# Altium schematic sheet ESC_2S.SchDoc: Init Title in DocParam
size A4; Organization: Use Organization_Name in ProjParam; Address1: Daniel Burnier; Address2: STI-IMT-LSRO1; Address3: EPFL; Address4: CH-1015 LAUSANNE; DocumentNumber: Init DocumentNumber in DocParam; Revision: A; SheetNumber: 1; SheetTotal: 1; ApprovedBy: Init ApprovedBy in DocParam; CheckedBy: Init CheckedBy in DocParam; Author: Init Author in DocParam; CompanyName: Init CompanyName in DocParam; DrawnBy: Init DrawBy in DocParam; Engineer: Init Engineer in DocParam; Title2: Init Title2 in DocParam; DocumentName: Init DocumentName in DocParam; ProjectName: Init ProjectName in DocParam
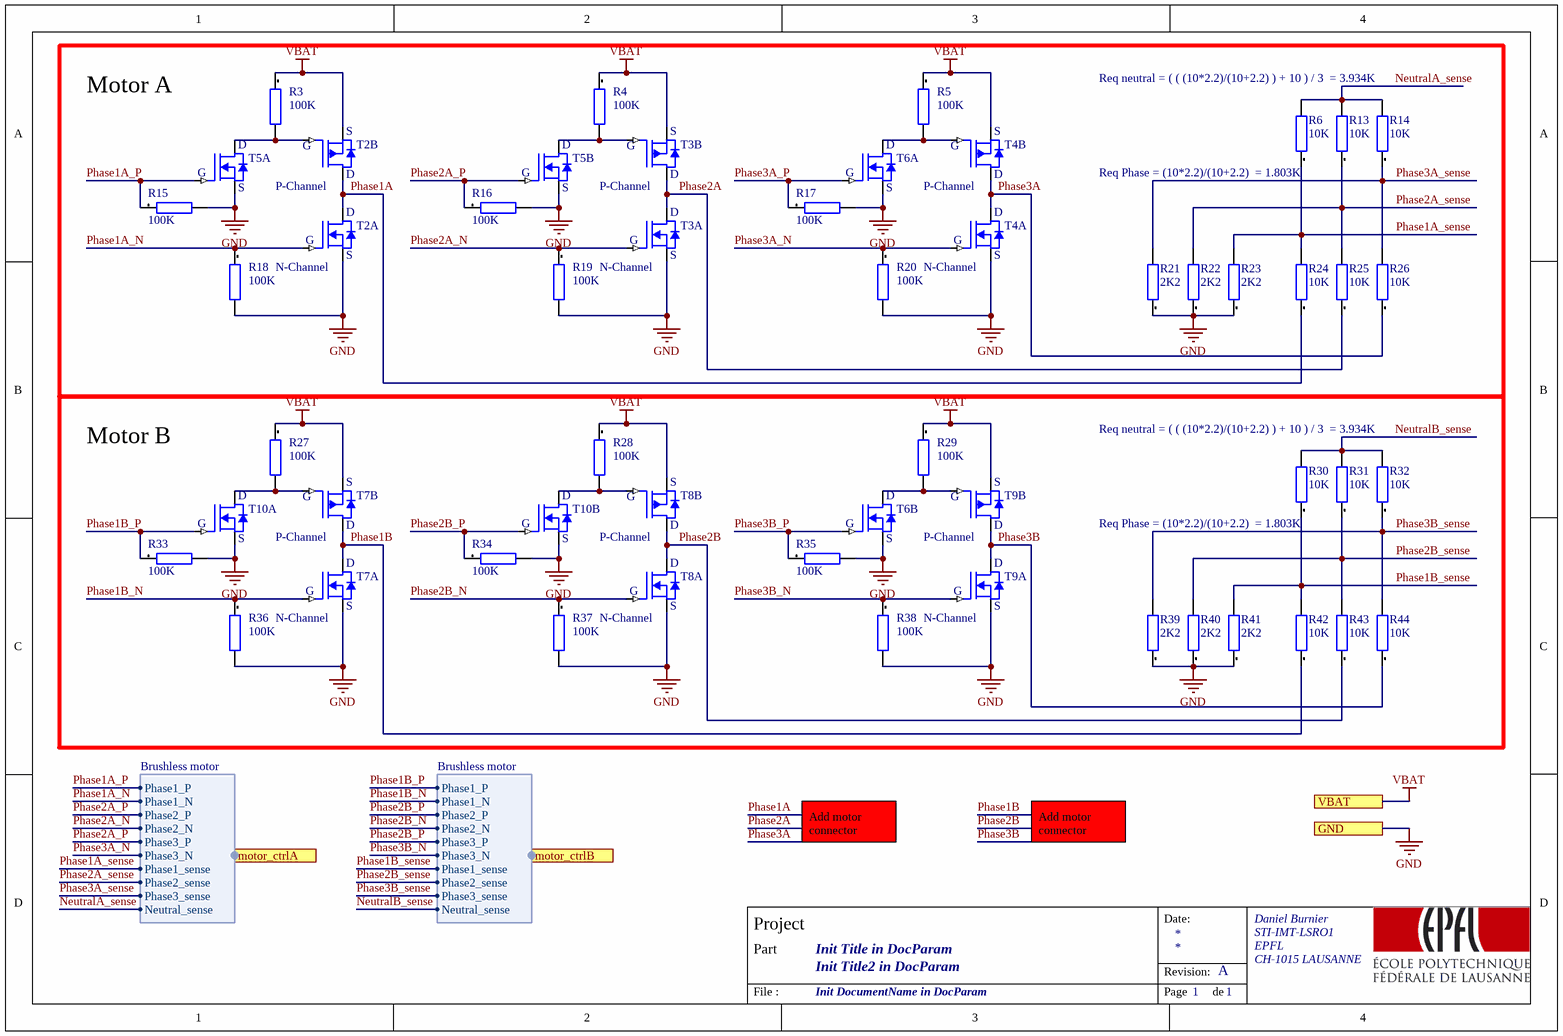
[diagram p0: ESC_2S.SchDoc]

## Parts
R3  100K  [RESC0201(0603)_L]
R4  100K  [RESC0201(0603)_L]
R5  100K  [RESC0201(0603)_L]
R6  10K  [RESC0201(0603)_L]
R13  10K  [RESC0201(0603)_L]
R14  10K  [RESC0201(0603)_L]
R15  100K  [RESC0201(0603)_L]
R16  100K  [RESC0201(0603)_L]
R17  100K  [RESC0201(0603)_L]
R18  100K  [RESC0201(0603)_L]
R19  100K  [RESC0201(0603)_L]
R20  100K  [RESC0201(0603)_L]
R21  2K2  [RESC0201(0603)_L]
R22  2K2  [RESC0201(0603)_L]
R23  2K2  [RESC0201(0603)_L]
R24  10K  [RESC0201(0603)_L]
R25  10K  [RESC0201(0603)_L]
R26  10K  [RESC0201(0603)_L]
R27  100K  [RESC0201(0603)_L]
R28  100K  [RESC0201(0603)_L]
R29  100K  [RESC0201(0603)_L]
R30  10K  [RESC0201(0603)_L]
R31  10K  [RESC0201(0603)_L]
R32  10K  [RESC0201(0603)_L]
R33  100K  [RESC0201(0603)_L]
R34  100K  [RESC0201(0603)_L]
R35  100K  [RESC0201(0603)_L]
R36  100K  [RESC0201(0603)_L]
R37  100K  [RESC0201(0603)_L]
R38  100K  [RESC0201(0603)_L]
R39  2K2  [RESC0201(0603)_L]
R40  2K2  [RESC0201(0603)_L]
R41  2K2  [RESC0201(0603)_L]
R42  10K  [RESC0201(0603)_L]
R43  10K  [RESC0201(0603)_L]
R44  10K  [RESC0201(0603)_L]
T2  ECH8668-TL-H  [8-SMD Flat lead]  (value not drawn)  (parts A,B of 2)
T3  ECH8668-TL-H  [8-SMD Flat lead]  (value not drawn)  (parts A,B of 2)
T4  ECH8668-TL-H  [8-SMD Flat lead]  (value not drawn)  (parts A,B of 2)
T5  PMDXB550UNEZ  [DFN1010B-6]  (value not drawn)  (parts A,B of 2)
T6  PMDXB550UNEZ  [DFN1010B-6]  (value not drawn)  (parts A,B of 2)
T7  ECH8668-TL-H  [8-SMD Flat lead]  (value not drawn)  (parts A,B of 2)
T8  ECH8668-TL-H  [8-SMD Flat lead]  (value not drawn)  (parts A,B of 2)
T9  ECH8668-TL-H  [8-SMD Flat lead]  (value not drawn)  (parts A,B of 2)
T10  PMDXB550UNEZ  [DFN1010B-6]  (value not drawn)  (parts A,B of 2)

## Blocks framed on the sheet
Motor A: R3-R6 R13-R26 T2-T6
Motor B: R27-R44 T6-T10

## Ports
GND, motor_ctrlA (harness Brushless motor), motor_ctrlB (harness Brushless motor), VBAT

## Harnesses
Brushless motor: Phase1_P, Phase1_N, Phase2_P, Phase2_N, Phase3_P, Phase3_N, Phase1_sense, Phase2_sense, Phase3_sense, Neutral_sense

## Nets
GND: R15.2 R16.2 R17.2 R18.2 R19.2 R20.2 R21.1 R22.1 R23.1 R33.2 R34.2 R35.2 R36.2 R37.2 R38.2 R39.1 R40.1 R41.1 T2.1(S) T3.1(S) T4.1(S) T5.1(S) T5.4(S) T6.1(S) T6.4(S) T7.1(S) T8.1(S) T9.1(S) T10.1(S) T10.4(S) ; port GND
VBAT: R3.1 R4.1 R5.1 R27.1 R28.1 R29.1 T2.3(S) T3.3(S) T4.3(S) T7.3(S) T8.3(S) T9.3(S) ; port VBAT
NeutralA_sense: R6.2 R13.2 R14.2 ; port motor_ctrlA.Neutral_sense
NeutralB_sense: R30.2 R31.2 R32.2 ; port motor_ctrlB.Neutral_sense
Phase1A: R24.1 T2.5(D) T2.6(D)
Phase1A_N: R18.1 T2.2(G) ; port motor_ctrlA.Phase1_N
Phase1A_P: R15.1 T5.2(G) ; port motor_ctrlA.Phase1_P
Phase1A_sense: R6.1 R23.2 R24.2 ; port motor_ctrlA.Phase1_sense
Phase1B: R42.1 T7.5(D) T7.6(D)
Phase1B_N: R36.1 T7.2(G) ; port motor_ctrlB.Phase1_N
Phase1B_P: R33.1 T10.2(G) ; port motor_ctrlB.Phase1_P
Phase1B_sense: R30.1 R41.2 R42.2 ; port motor_ctrlB.Phase1_sense
Phase2A: R25.1 T3.5(D) T3.6(D)
Phase2A_N: R19.1 T3.2(G) ; port motor_ctrlA.Phase2_N
Phase2A_P: R16.1 T5.5(G) ; port motor_ctrlA.Phase2_P, port motor_ctrlA.Phase3_P
Phase2A_sense: R13.1 R22.2 R25.2 ; port motor_ctrlA.Phase2_sense
Phase2B: R43.1 T8.5(D) T8.6(D)
Phase2B_N: R37.1 T8.2(G) ; port motor_ctrlB.Phase2_N
Phase2B_P: R34.1 T10.5(G) ; port motor_ctrlB.Phase2_P, port motor_ctrlB.Phase3_P
Phase2B_sense: R31.1 R40.2 R43.2 ; port motor_ctrlB.Phase2_sense
Phase3A: R26.1 T4.5(D) T4.6(D)
Phase3A_N: R20.1 T4.2(G) ; port motor_ctrlA.Phase3_N
Phase3A_P: R17.1 T6.2(G)
Phase3A_sense: R14.1 R21.2 R26.2 ; port motor_ctrlA.Phase3_sense
Phase3B: R44.1 T9.5(D) T9.6(D)
Phase3B_N: R38.1 T9.2(G) ; port motor_ctrlB.Phase3_N
Phase3B_P: R35.1 T6.5(G)
Phase3B_sense: R32.1 R39.2 R44.2 ; port motor_ctrlB.Phase3_sense
NetR3_2: R3.2 T2.4(G) T5.6(D)
NetR4_2: R4.2 T3.4(G) T5.3(D)
NetR5_2: R5.2 T4.4(G) T6.6(D)
NetR27_2: R27.2 T7.4(G) T10.6(D)
NetR28_2: R28.2 T8.4(G) T10.3(D)
NetR29_2: R29.2 T6.3(D) T9.4(G)

## Notes on the sheet
- Req neutral = ( ( (10*2.2)/(10+2.2) ) + 10 ) / 3  = 3.934K
- Req Phase = (10*2.2)/(10+2.2)  = 1.803K
- Add motor connector
- Date:
- Project
- Part
- Revision:
- File :
- Page
- de
- (in symbol ECH8668-TL-H, part A) N-Channel
- (in symbol ECH8668-TL-H, part B) P-Channel

## Library data of the parts
R3-R6 R13-R44 = TBD[[/\]]0201[[/\]]1: Resistor ToDo 0201; Preference: 1; Currentie: CHF; Size: 0201; Footprint Acort: 0201; ROHS: True; DateLastUpdate: 2018-10-19 / 9:06:49 AM
T2-T4 T7-T9 = ECH8668-TL-H: MOSFET N/P-CH 20V 7.5A/5A ECH8; Manufacturer: ON Semiconductor; FET Type: N and P-Channel; FET Feature: Logic Level Gate; Current - Continuous Drain (Id) @ 25°C: 7.5A, 5A; Rds On (Max) @ Id, Vgs: 17 mOhm @ 4A, 4.5V; Gate Charge (Qg) (Max) @ Vgs: 10.8nC @ 4.5V; Input Capacitance (Ciss) (Max) @ Vds: 1060pF @ 10V; Power - Max: 1.5W; Supplier 1: Digi-Key; Manufacturer Part Number: ECH8668-TL-H; RoHS: RoHS Compliant; Category: Discrete Semiconductor Products; Stock 1: 3111; Pricing 1: 1=0.93, 10=0.811, 100=0.6259, 500=0.46362, 1000=0.37089 (USD); Packaging: Cut Tape (CT); Part Status: Active; Drain to Source Voltage (Vdss): 20V; Vgs(th) (Max) @ Id: -; Operating Temperature: 150°C (TJ); Mounting Type: Surface Mount; Package / Case: 8-SMD, Flat Lead; Supplier Device Package: 8-ECH; ComponentLink1URL: http://www.onsemi.com/pub/Collateral/ECH8668-D.PDF; ComponentLink1Description: http://www.onsemi.com/pub/Collateral/ECH8668-D.PDF; Supplier Part Number 1: ECH8668-TL-HOSCT-ND
T5 T6 T10 = PMDXB550UNEZ: DUAL N-CHANNEL 30V; Manufacturer: NXP Semiconductors; Continuous Drain Current (ID): 590mA; Max Power Dissipation: 285mW; Rds On Max: 670mR; Input Capacitance: 30.3pF; FET Type: 2 N-Channel; Supplier 1: Digi-Key; Stock 1: 5582; Pricing 1: 1=0.48, 10=0.379, 100=0.2601, 500=0.17838, 1000=0.13379 (USD); Mount: Surface Mount; Min Operating Temperature: -55°C; Max Operating Temperature: 150°C; Drain to Source Voltage (Vdss): 30V; Packaging: Tape and Reel; Supplier Part Number 1: 1727-2277-1-ND; Manufacturer Part Number: PMDXB550UNEZ